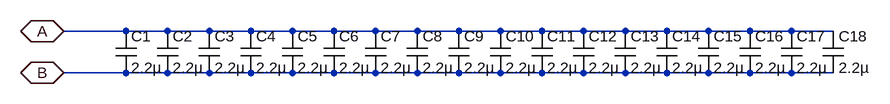
[diagram p0: schematic FL1.asc]
FL1.asc, the LTspice schematic file:
Version 4.1
SHEET 1 1280 680
WIRE 128 112 32 112
WIRE 192 112 128 112
WIRE 256 112 192 112
WIRE 320 112 256 112
WIRE 384 112 320 112
WIRE 448 112 384 112
WIRE 512 112 448 112
WIRE 576 112 512 112
WIRE 640 112 576 112
WIRE 704 112 640 112
WIRE 768 112 704 112
WIRE 832 112 768 112
WIRE 896 112 832 112
WIRE 960 112 896 112
WIRE 1024 112 960 112
WIRE 1088 112 1024 112
WIRE 1152 112 1088 112
WIRE 1216 112 1152 112
WIRE 128 176 32 176
WIRE 192 176 128 176
WIRE 256 176 192 176
WIRE 320 176 256 176
WIRE 384 176 320 176
WIRE 448 176 384 176
WIRE 512 176 448 176
WIRE 576 176 512 176
WIRE 640 176 576 176
WIRE 704 176 640 176
WIRE 768 176 704 176
WIRE 832 176 768 176
WIRE 896 176 832 176
WIRE 960 176 896 176
WIRE 1024 176 960 176
WIRE 1088 176 1024 176
WIRE 1152 176 1088 176
WIRE 1216 176 1152 176
FLAG 32 112 A
IOPIN 32 112 BiDir
FLAG 32 176 B
IOPIN 32 176 BiDir
SYMBOL cap 112 112 R0
SYMATTR InstName C1
SYMATTR Value 2.2µ
SYMATTR SpiceLine V=450 Rser=0.0043 Lser=0.65n Rpar=0.227G
SYMBOL cap 176 112 R0
SYMATTR InstName C2
SYMATTR Value 2.2µ
SYMATTR SpiceLine V=450 Rser=0.0043 Lser=0.65n Rpar=0.227G
SYMBOL cap 240 112 R0
SYMATTR InstName C3
SYMATTR Value 2.2µ
SYMATTR SpiceLine V=450 Rser=0.0043 Lser=0.65n Rpar=0.227G
SYMBOL cap 304 112 R0
SYMATTR InstName C4
SYMATTR Value 2.2µ
SYMATTR SpiceLine V=450 Rser=0.0043 Lser=0.65n Rpar=0.227G
SYMBOL cap 368 112 R0
SYMATTR InstName C5
SYMATTR Value 2.2µ
SYMATTR SpiceLine V=450 Rser=0.0043 Lser=0.65n Rpar=0.227G
SYMBOL cap 432 112 R0
SYMATTR InstName C6
SYMATTR Value 2.2µ
SYMATTR SpiceLine V=450 Rser=0.0043 Lser=0.65n Rpar=0.227G
SYMBOL cap 496 112 R0
SYMATTR InstName C7
SYMATTR Value 2.2µ
SYMATTR SpiceLine V=450 Rser=0.0043 Lser=0.65n Rpar=0.227G
SYMBOL cap 560 112 R0
SYMATTR InstName C8
SYMATTR Value 2.2µ
SYMATTR SpiceLine V=450 Rser=0.0043 Lser=0.65n Rpar=0.227G
SYMBOL cap 624 112 R0
SYMATTR InstName C9
SYMATTR Value 2.2µ
SYMATTR SpiceLine V=450 Rser=0.0043 Lser=0.65n Rpar=0.227G
SYMBOL cap 688 112 R0
SYMATTR InstName C10
SYMATTR Value 2.2µ
SYMATTR SpiceLine V=450 Rser=0.0043 Lser=0.65n Rpar=0.227G
SYMBOL cap 752 112 R0
SYMATTR InstName C11
SYMATTR Value 2.2µ
SYMATTR SpiceLine V=450 Rser=0.0043 Lser=0.65n Rpar=0.227G
SYMBOL cap 816 112 R0
SYMATTR InstName C12
SYMATTR Value 2.2µ
SYMATTR SpiceLine V=450 Rser=0.0043 Lser=0.65n Rpar=0.227G
SYMBOL cap 880 112 R0
SYMATTR InstName C13
SYMATTR Value 2.2µ
SYMATTR SpiceLine V=450 Rser=0.0043 Lser=0.65n Rpar=0.227G
SYMBOL cap 944 112 R0
SYMATTR InstName C14
SYMATTR Value 2.2µ
SYMATTR SpiceLine V=450 Rser=0.0043 Lser=0.65n Rpar=0.227G
SYMBOL cap 1008 112 R0
SYMATTR InstName C15
SYMATTR Value 2.2µ
SYMATTR SpiceLine V=450 Rser=0.0043 Lser=0.65n Rpar=0.227G
SYMBOL cap 1072 112 R0
SYMATTR InstName C16
SYMATTR Value 2.2µ
SYMATTR SpiceLine V=450 Rser=0.0043 Lser=0.65n Rpar=0.227G
SYMBOL cap 1136 112 R0
SYMATTR InstName C17
SYMATTR Value 2.2µ
SYMATTR SpiceLine V=450 Rser=0.0043 Lser=0.65n Rpar=0.227G
SYMBOL cap 1200 112 R0
SYMATTR InstName C18
SYMATTR Value 2.2µ
SYMATTR SpiceLine V=450 Rser=0.0043 Lser=0.65n Rpar=0.227G

The netlist it stands for:
* FL1.asc
C1 A B 2.2µ V=450 Rser=0.0043 Lser=0.65n Rpar=0.227G
C2 A B 2.2µ V=450 Rser=0.0043 Lser=0.65n Rpar=0.227G
C3 A B 2.2µ V=450 Rser=0.0043 Lser=0.65n Rpar=0.227G
C4 A B 2.2µ V=450 Rser=0.0043 Lser=0.65n Rpar=0.227G
C5 A B 2.2µ V=450 Rser=0.0043 Lser=0.65n Rpar=0.227G
C6 A B 2.2µ V=450 Rser=0.0043 Lser=0.65n Rpar=0.227G
C7 A B 2.2µ V=450 Rser=0.0043 Lser=0.65n Rpar=0.227G
C8 A B 2.2µ V=450 Rser=0.0043 Lser=0.65n Rpar=0.227G
C9 A B 2.2µ V=450 Rser=0.0043 Lser=0.65n Rpar=0.227G
C10 A B 2.2µ V=450 Rser=0.0043 Lser=0.65n Rpar=0.227G
C11 A B 2.2µ V=450 Rser=0.0043 Lser=0.65n Rpar=0.227G
C12 A B 2.2µ V=450 Rser=0.0043 Lser=0.65n Rpar=0.227G
C13 A B 2.2µ V=450 Rser=0.0043 Lser=0.65n Rpar=0.227G
C14 A B 2.2µ V=450 Rser=0.0043 Lser=0.65n Rpar=0.227G
C15 A B 2.2µ V=450 Rser=0.0043 Lser=0.65n Rpar=0.227G
C16 A B 2.2µ V=450 Rser=0.0043 Lser=0.65n Rpar=0.227G
C17 A B 2.2µ V=450 Rser=0.0043 Lser=0.65n Rpar=0.227G
C18 A B 2.2µ V=450 Rser=0.0043 Lser=0.65n Rpar=0.227G
.backanno
.end